# EasyEDA schematic SCH_CubeSat(Arduino)_2024-08-11.json
TITLE: ATL Marathon Satellite Schematic; REV: 1.0; Date: 2024-08-11; Sheet: 1/1; Drawn By: Keyaan Khatri
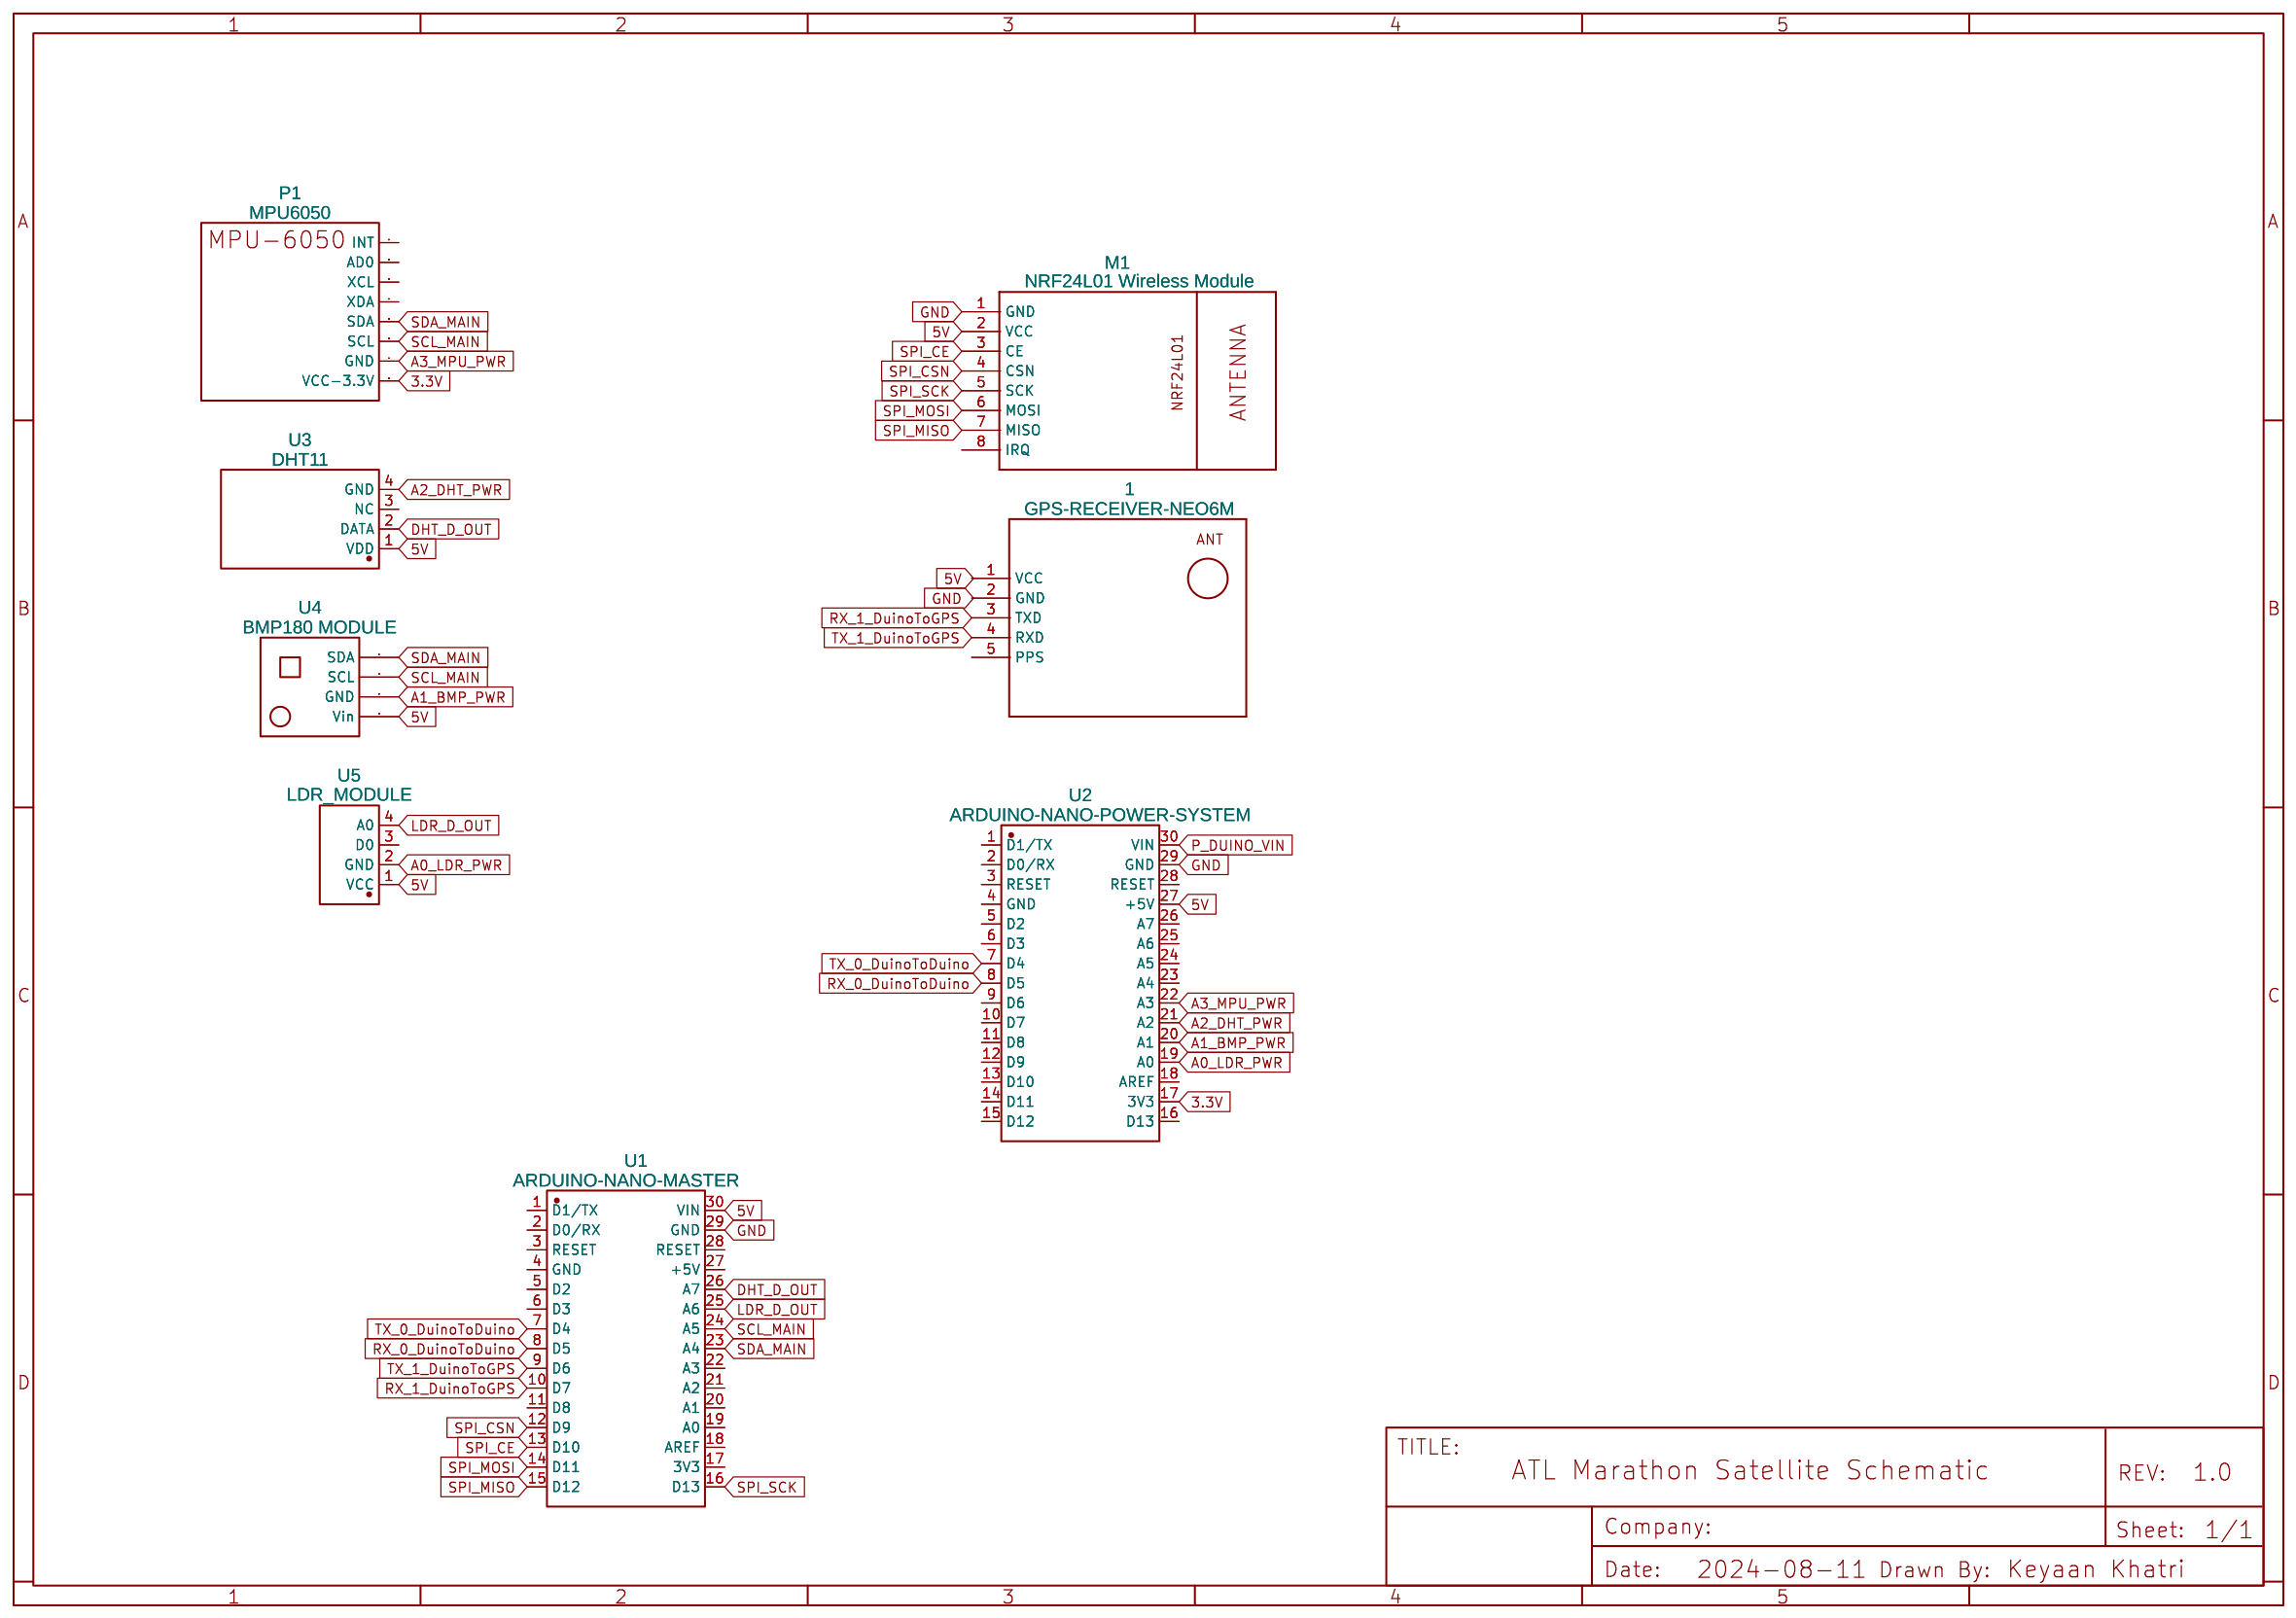
[diagram p0: schematic sheet]

## Parts
1  GPS-RECEIVER-NEO6M  [GPS-RECEIVER-NEO6M]
M1  NRF24L01 Wireless Module  [WIRELESS-NRF24L01]
P1  MPU6050  [MPU-6050]
U1  ARDUINO-NANO-MASTER  [COMM-TH_ARDUINO_NANO]
U2  ARDUINO-NANO-POWER-SYSTEM  [COMM-TH_ARDUINO_NANO]
U3  DHT11  [SENSOR-TH_DHT11]
U4  BMP180 MODULE  [BMP180 MODULE (HW-596)]
U5  LDR_MODULE  [LDR_MODULE]

## Library data of the parts
1 = GPS-RECEIVER-NEO6M: Contributor: Otto Sonneveld
M1 = NRF24L01 Wireless Module: Contributor: Asad Ullah Shaban
P1 = MPU6050: Manufacturer: None; Manufacturer Part: Female headerHDR1X8-2.54; Supplier Part: C27438; Contributor: Sarecs
U1 U2 = ARDUINO_NANO: Contributor: lcsc; Supplier: LCSC; Supplier Part: C9900017879; Manufacturer: null; JLCPCB Part Class: Extended Part; link: https://lcsc.com/eda_search?q=C9900017879&%26type=1&ref=editor
U3 = DHT11: Contributor: LCSC; Supplier: LCSC; Supplier Part: C117051; Manufacturer: 广州奥松; JLCPCB Part Class: Extended Part; link: https://lcsc.com/eda_search?q=C117051&%26type=1&ref=editor
U4 = BMP180 MODULE: Manufacturer Part: BMP180 (HW-596); Contributor: esguti
U5 = LDR_MODULE: Contributor: dwipanjan

## Nets
3.3V: P1.8(VCC-3.3V) U2.17(3V3)
5V: M1.2(VCC) U1.30(VIN) U2.27(+5V) U3.1(VDD) U4.1(Vin) U5.1(VCC)
GND: M1.1(GND) U1.29(GND) U2.29(GND)
A0_LDR_PWR: U2.19(A0) U5.2(GND)
A1_BMP_PWR: U2.20(A1) U4.2(GND)
A2_DHT_PWR: U2.21(A2) U3.4(GND)
A3_MPU_PWR: P1.7(GND) U2.22(A3)
DHT_D_OUT: U1.26(A7) U3.2(DATA)
LDR_D_OUT: U1.25(A6) U5.4(A0)
P_DUINO_VIN: U2.30(VIN)
RX_0_DuinoToDuino: U1.8(D5) U2.8(D5)
RX_1_DuinoToGPS: 1.3(TXD) U1.10(D7)
SCL_MAIN: P1.6(SCL) U1.24(A5) U4.3(SCL)
SDA_MAIN: P1.5(SDA) U1.23(A4) U4.4(SDA)
SPI_CE: M1.3(CE) U1.13(D10)
SPI_CSN: M1.4(CSN) U1.12(D9)
SPI_MISO: M1.7(MISO) U1.15(D12)
SPI_MOSI: M1.6(MOSI) U1.14(D11)
SPI_SCK: M1.5(SCK) U1.16(D13)
TX_0_DuinoToDuino: U1.7(D4) U2.7(D4)
TX_1_DuinoToGPS: 1.4(RXD) U1.9(D6)

Not connected (* = marked no-connect by the designer): 1 1(VCC) 2(GND) 5(PPS); M1 8(IRQ); P1 1(INT) 2(AD0) 3(XCL) 4(XDA); U1 1(D1/TX) 2(D0/RX) 3(RESET) 4(GND) 5(D2) 6(D3) 11(D8) 17(3V3) 18(AREF) 19(A0) 20(A1) 21(A2) 22(A3) 27(+5V) 28(RESET); U2 1(D1/TX) 2(D0/RX) 3(RESET) 4(GND) 5(D2) 6(D3) 9(D6) 10(D7) 11(D8) 12(D9) 13(D10) 14(D11) 15(D12) 16(D13) 18(AREF) 23(A4) 24(A5) 25(A6) 26(A7) 28(RESET); U3 3(NC); U5 3(D0)
